# EAGLE design blous-afich (EAGLE 8.3.2)
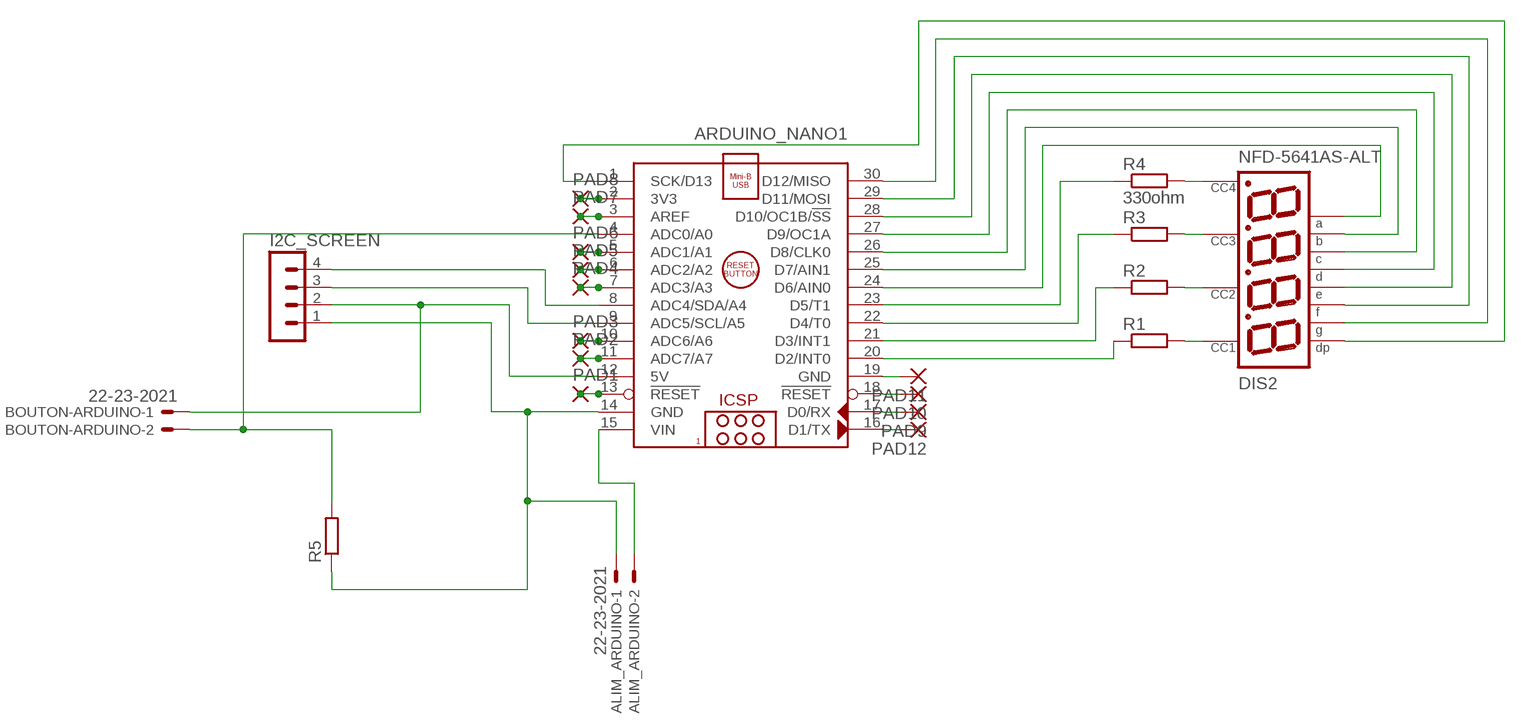
[diagram p0: schematic, sheet 1]

## Parts
ALIM_ARDUINO  22-23-2021  [22-23-2021]
ARDUINO_NANO1  ARDUINO_NANO  [ARDUINO_NANO]
BOUTON-ARDUINO  22-23-2021  [22-23-2021]
DIS2  NFD-5641AS-ALT  [NFD-5641]
I2C_SCREEN  MA04-1  [MA04-1]
PAD1  1,6/0,8  [1,6/0,8]
PAD2  1,6/0,8  [1,6/0,8]
PAD3  1,6/0,8  [1,6/0,8]
PAD4  1,6/0,8  [1,6/0,8]
PAD5  1,6/0,8  [1,6/0,8]
PAD6  1,6/0,8  [1,6/0,8]
PAD7  1,6/0,8  [1,6/0,8]
PAD8  1,6/0,8  [1,6/0,8]
PAD9  1,6/0,8  [1,6/0,8]
PAD10  1,6/0,8  [1,6/0,8]
PAD11  1,6/0,8  [1,6/0,8]
PAD12  1,6/0,8  [1,6/0,8]
R1  R-EU_0207/7  [0207/7]
R2  R-EU_0207/7  [0207/7]
R3  R-EU_0207/7  [0207/7]
R4  330ohm  R-EU_0207/7  [0207/7]
R5  R-EU_0207/7  [0207/7]

## Nets
N$1: ARDUINO_NANO1.20(D2/INT0) R1.1
N$2: ARDUINO_NANO1.21(D3/INT1) R2.1
N$3: ARDUINO_NANO1.22(D4/T0) R3.1
N$4: ARDUINO_NANO1.23(D5/T1) R4.1
N$5: DIS2.P$6 R4.2
N$6: DIS2.P$8 R3.2
N$7: DIS2.P$9 R2.2
N$8: DIS2.P$12 R1.2
N$9: ARDUINO_NANO1.24(D6/AIN0) DIS2.P$11
N$10: ARDUINO_NANO1.25(D7/AIN1) DIS2.P$7
N$11: ARDUINO_NANO1.26(D8/CLK0) DIS2.P$4
N$12: ARDUINO_NANO1.27(D9/OC1A) DIS2.P$2
N$13: ARDUINO_NANO1.28(D10/OC1B/!SS) DIS2.P$1
N$14: ARDUINO_NANO1.29(D11/MOSI) DIS2.P$10
N$15: ARDUINO_NANO1.30(D12/MISO) DIS2.P$5
N$16: ARDUINO_NANO1.1(SCK/D13) DIS2.P$3
N$17: ARDUINO_NANO1.8(ADC4/SDA/A4) I2C_SCREEN.4
N$18: ARDUINO_NANO1.9(ADC5/SCL/A5) I2C_SCREEN.3
N$19: ARDUINO_NANO1.12(5V) BOUTON-ARDUINO.1 I2C_SCREEN.2
N$20: ALIM_ARDUINO.1 ARDUINO_NANO1.14(GND) I2C_SCREEN.1 R5.1
N$21: ARDUINO_NANO1.4(ADC0/A0) BOUTON-ARDUINO.2 R5.2
N$22: ALIM_ARDUINO.2 ARDUINO_NANO1.15(VIN)
N$23: ARDUINO_NANO1.2(3V3) PAD8.1(P)
N$24: ARDUINO_NANO1.3(AREF) PAD7.1(P)
N$25: ARDUINO_NANO1.5(ADC1/A1) PAD6.1(P)
N$26: ARDUINO_NANO1.6(ADC2/A2) PAD5.1(P)
N$27: ARDUINO_NANO1.7(ADC3/A3) PAD4.1(P)
N$28: ARDUINO_NANO1.10(ADC6/A6) PAD3.1(P)
N$29: ARDUINO_NANO1.11(ADC7/A7) PAD2.1(P)
N$30: ARDUINO_NANO1.19(GND) PAD11.1(P)
N$31: ARDUINO_NANO1.18(!RESET) PAD10.1(P)
N$32: ARDUINO_NANO1.17(D0/RX) PAD9.1(P)
N$33: ARDUINO_NANO1.16(D1/TX) PAD12.1(P)
N$34: ARDUINO_NANO1.13(!RESET) PAD1.1(P)

## Library data of the parts
ALIM_ARDUINO BOUTON-ARDUINO = con-molex:22-23-2021: .100" (2.54mm) Center Header - 2 Pin; MF: MOLEX; MPN: 22-23-2021; OC_FARNELL: 1462926; OC_NEWARK: 25C3832
ARDUINO_NANO1 = ArduinoNanoV30:ARDUINO_NANO: Arduino Nano V3.0 Module Overview: The Arduino Nano is a small, complete, and breadboard-friendly board based on the ATmega328 (Arduino Nano 3.x) or ATmega168 (Arduino Nano 2.x). It has more or less the same functionality of the Arduino Duemilanove, but in a different package. It lacks only a DC power jack, and works with a Mini-B USB cable instead of a standard one. The Nano was designed and is being produced by Gravitech <http://www.gravitech.us/arna30wiatp.html>. General specifications: Item Value Microcontroller Atmel ATmega168 or ATmega328 Operating Voltage (logic level) 5 V Input Voltage (recommended) 7-12 V Input Voltage (limits) 6-20 V Digital I/O Pins 14 (of which 6 provide PWM output) Analog Input Pins 8 DC Current per I/O Pin 40 mA Flash Memory 16 KB (ATmega168) or 32 KB (ATmega328) of which 2 KB used by bootloader SRAM 1 KB (ATmega168) or 2 KB (ATmega328) EEPROM 512 bytes (ATmega168) or 1 KB (ATmega328) Clock Speed 16 MHz Dimensions (Inches) 0.73" x 1.70" Dimensions (mm) 18mm x 45mm Overall height About 9 mm (not including pins) Weigth 5 g Power: The Arduino Nano can be powered via the Mini-B USB connection, 6-20V unregulated external power supply (pin 30), or 5V regulated external power supply (pin 27). The power source is automatically selected to the highest voltage source. Memory: The ATmega168 has 16 KB of flash memory for storing code (of which 2 KB is used for the bootloader); the ATmega328 has 32 KB, (also with 2 KB used for the bootloader). The ATmega168 has 1 KB of SRAM and 512 bytes of EEPROM (which can be read and written with the EEPROM library); the ATmega328 has 2 KB of SRAM and 1 KB of EEPROM. Input and Output: Each of the 14 digital pins on the Nano can be used as an input or output, using pinMode(), digitalWrite(), and digitalRead() functions. They operate at 5 volts. Each pin can provide or receive a maximum of 40 mA and has an internal pull-up resistor (disconnected by default) of 20-50 kOhms. In addition, some pins have specialized functions. Visit Arduino - ArduinoBoardNano <https://www.arduino.cc/en/Main/ArduinoBoardNano>
DIS2 = display-nfd:NFD-5641AS-ALT: Four Digit 0.56" CC Seven-Segment LED Display Futurlec part number: 7FR5641AS Created by RobG
I2C_SCREEN = con-lstb:MA04-1: PIN HEADER; OC_FARNELL: unknown; OC_NEWARK: unknown
PAD1-PAD12 = wirepad:1,6/0,8: THROUGH-HOLE PAD
R1-R5 = rcl:R-EU_: RESISTOR, European symbol

## Board
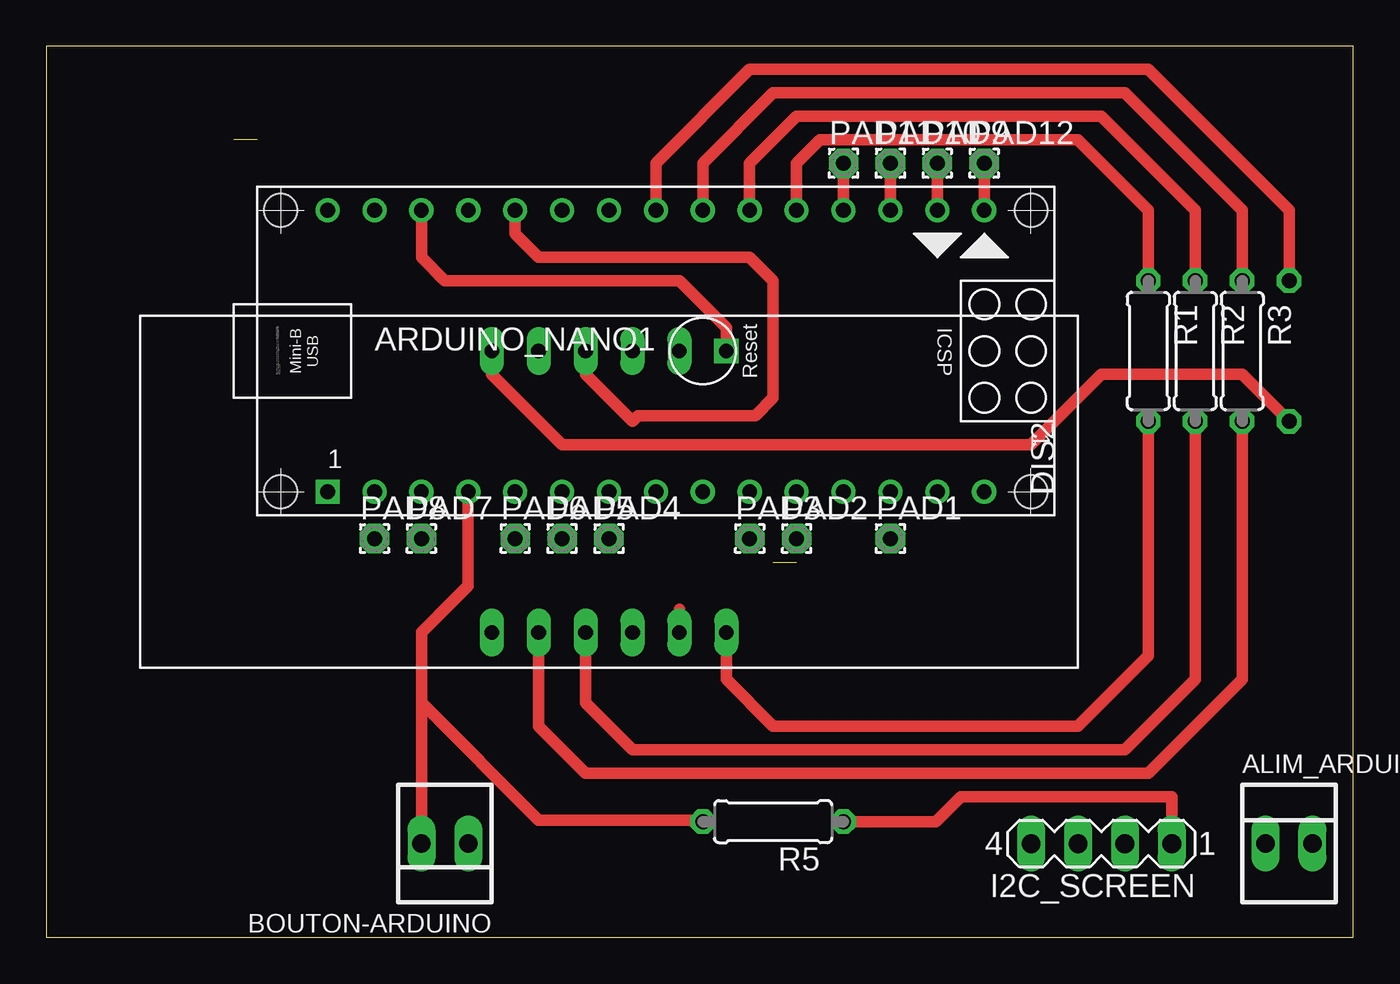
[diagram p1: board, top side]
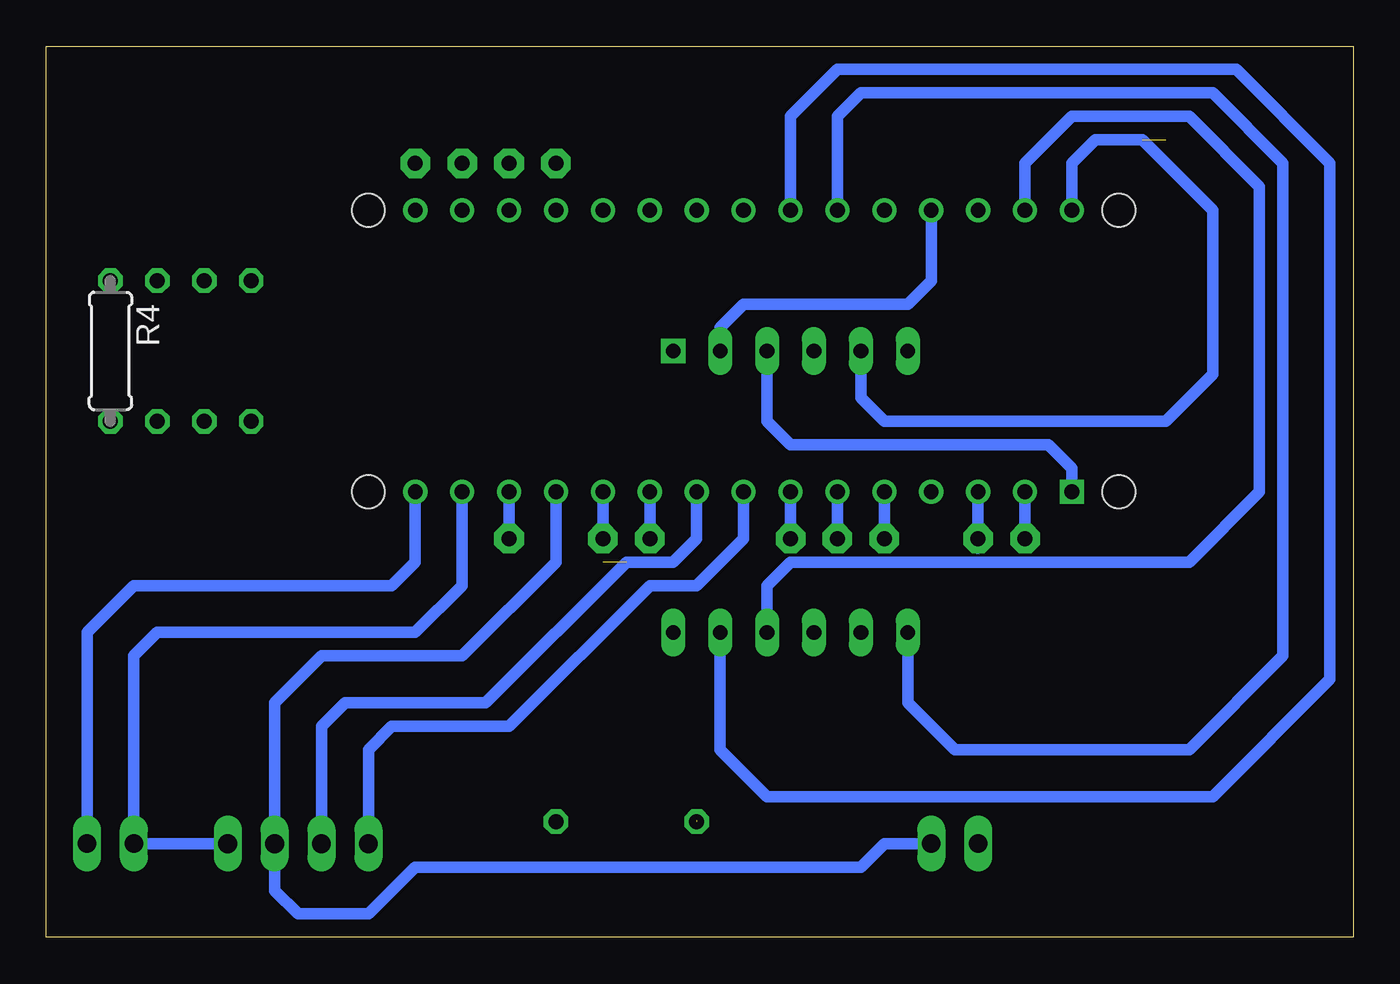
[diagram p2: board, bottom side, seen from below]

Size 70.79 x 48.25 mm. Coordinates in mm from the lower left corner, seen from the top.
Outline: 0,0 70.79,0 70.79,48.25 0,48.25 0,0
Copper layers (1*16): Top 0.035mm / dielectric 1.5mm / Bottom 0.035mm
Design rules "default": minimum track width 6mil, minimum drill 0.35mm, track to track 6mil, track to pad 6mil, pad to pad 6mil, via to via 6mil, smd to smd 6mil, copper to edge 40mil, drill to drill 6mil, minimum pad ring 10mil, minimum via ring 8mil, stop-mask expansion 4mil, vias tented up to drill 0mil, thermal gap 10mil

### Footprints (pad centres in the part's own frame; a part is rotated, then mirrored left to right if it is on the bottom)
22-23-2021 = drill 1 long: 1 -1.27,0; 2 1.27,0
ARDUINO_NANO = drill 0.8 square: 1 -20.32,-7.62 | drill 0.8: 2 -17.78,-7.62; 3 -15.24,-7.62; 4 -12.7,-7.62; 5 -10.16,-7.62; 6 -7.62,-7.62; 7 -5.08,-7.62; 8 -2.54,-7.62; 9 0,-7.62; 10 2.54,-7.62; 11 5.08,-7.62; 12 7.62,-7.62; 13 10.16,-7.62; 14 12.7,-7.62; 15 15.24,-7.62; 16 15.24,7.62; 17 12.7,7.62; 18 10.16,7.62; 19 7.62,7.62; 20 5.08,7.62; 21 2.54,7.62; 22 0,7.62; 23 -2.54,7.62; 24 -5.08,7.62; 25 -7.62,7.62; 26 -10.16,7.62; 27 -12.7,7.62; 28 -15.24,7.62; 29 -17.78,7.62; 30 -20.32,7.62 | hole 1.778: -22.86,-7.62; -22.86,7.62; 17.78,7.62; 17.78,-7.62
NFD-5641 = drill 0.8 square: P$1 -6.35,-7.62 | drill 0.8 long: P$2 -3.81,-7.62; P$3 -1.27,-7.62; P$4 1.27,-7.62; P$5 3.81,-7.62; P$6 6.35,-7.62; P$7 6.35,7.62; P$8 3.81,7.62; P$9 1.27,7.62; P$10 -1.27,7.62; P$11 -3.81,7.62; P$12 -6.35,7.62
MA04-1 = drill 1.016 long: 1 -3.81,0; 2 -1.27,0; 3 1.27,0; 4 3.81,0
1,6/0,8 = drill 0.813 pad 1.6 octagon: 1 0,0
0207/7 = drill 0.813 octagon: 1 -3.81,0; 2 3.81,0

### Placement (x,y rotation side)
ALIM_ARDUINO  67.31,5.08 0 top
ARDUINO_NANO1  35.56,31.75 0 top
BOUTON-ARDUINO  21.59,5.08 180 top
DIS2  30.48,24.13 180 top
I2C_SCREEN  57.15,5.08 180 top
PAD1  45.72,21.59 0 top
PAD2  40.64,21.59 0 top
PAD3  38.1,21.59 0 top
PAD4  30.48,21.59 0 top
PAD5  27.94,21.59 0 top
PAD6  25.4,21.59 0 top
PAD7  20.32,21.59 0 top
PAD8  17.78,21.59 0 top
PAD9  48.26,41.91 0 top
PAD10  45.72,41.91 0 top
PAD11  43.18,41.91 0 top
PAD12  50.8,41.91 0 top
R1  59.69,31.75 270 top
R2  62.23,31.75 270 top
R3  64.77,31.75 270 top
R4  67.31,31.75 270 bottom
R5  39.37,6.27 180 top

### Tracks (layer width: path | path; a pad name or v marks a point on that pad's centre or on a via)
N$1
  Top 0.61: ARDUINO_NANO1.20 40.64,41.91 41.91,43.18 55.88,43.18 59.69,39.37 R1.1
N$2
  Top 0.61: R2.1 62.23,39.37 57.15,44.45 40.64,44.45 38.1,41.91 ARDUINO_NANO1.21
N$3
  Top 0.61: R3.1 64.77,39.37 58.42,45.72 39.37,45.72 35.56,41.91 ARDUINO_NANO1.22
N$4
  Top 0.61: R4.1 67.31,39.37 59.69,46.99 38.1,46.99 33.02,41.91 ARDUINO_NANO1.23
N$5
  Top 0.61: R4.2 64.77,30.48 57.15,30.48 55.88,29.21 | DIS2.P$6 24.13,30.48 27.94,26.67 53.34,26.67 55.88,29.21 | 55.88,29.21 54.61,27.94
N$6
  Top 0.61: R3.2 64.77,13.97 59.69,8.89 29.21,8.89 26.67,11.43 DIS2.P$8
N$7
  Top 0.61: R2.2 62.23,13.97 58.42,10.16 31.75,10.16 29.21,12.7 DIS2.P$9
N$8
  Top 0.61: DIS2.P$12 36.83,13.97 39.37,11.43 55.88,11.43 59.69,15.24 R1.2
N$9
  Top 0.61: 34.29,17.78 DIS2.P$11
  Bottom 0.61: ARDUINO_NANO1.24 30.48,44.45 27.94,46.99 6.35,46.99 1.27,41.91 1.27,13.97 7.62,7.62 31.75,7.62 34.29,10.16 DIS2.P$11
N$10
  Bottom 0.61: ARDUINO_NANO1.25 27.94,44.45 26.67,45.72 7.62,45.72 3.81,41.91 3.81,15.24 8.89,10.16 21.59,10.16 24.13,12.7 DIS2.P$7
N$11
  Top 0.61: ARDUINO_NANO1.26 25.4,38.1 26.67,36.83 38.1,36.83 39.37,35.56 39.37,29.21 38.41,28.24 32.06,28.24 31.75,27.94 29.21,30.48 DIS2.P$4
N$12
  Bottom 0.61: DIS2.P$2 34.29,33.02 33.02,34.29 24.13,34.29 22.86,35.56 ARDUINO_NANO1.27
N$13
  Top 0.61: DIS2.P$1 36.83,33.02 34.29,35.56 21.59,35.56 20.32,36.83 ARDUINO_NANO1.28
N$14
  Bottom 0.61: DIS2.P$10 31.75,19.05 30.48,20.32 8.89,20.32 5.08,24.13 5.08,40.64 8.89,44.45 15.24,44.45 17.78,41.91 ARDUINO_NANO1.29
N$15  (1 unrouted)
  Bottom 0.61: DIS2.P$5 26.67,29.21 25.4,27.94 10.16,27.94 7.62,30.48 7.62,39.37 11.43,43.18 13.97,43.18 15.24,41.91 ARDUINO_NANO1.30
N$16
  Bottom 0.61: ARDUINO_NANO1.1 15.24,25.4 16.51,26.67 30.48,26.67 31.75,27.94 DIS2.P$3
N$17
  Bottom 0.61: ARDUINO_NANO1.8 33.02,21.59 35.56,19.05 38.1,19.05 45.72,11.43 52.07,11.43 53.34,10.16 I2C_SCREEN.4
N$18  (1 unrouted)
  Bottom 0.61: ARDUINO_NANO1.9 35.56,21.59 36.83,20.32 39.37,20.32 46.99,12.7 54.61,12.7 55.88,11.43 I2C_SCREEN.3
N$19
  Bottom 0.61: ARDUINO_NANO1.12 43.18,20.32 48.26,15.24 55.88,15.24 58.42,12.7 I2C_SCREEN.2 58.42,2.54 57.15,1.27 53.34,1.27 50.8,3.81 26.67,3.81 25.4,5.08 BOUTON-ARDUINO.1
N$20
  Top 0.61: I2C_SCREEN.1 60.96,7.62 49.53,7.62 48.18,6.27 R5.1
  Bottom 0.61: I2C_SCREEN.1 ALIM_ARDUINO.1 66.04,15.24 64.77,16.51 50.8,16.51 48.26,19.05 ARDUINO_NANO1.14
N$21  (1 unrouted)
  Top 0.61: 20.32,12.7 20.32,6.35 | 20.32,6.35 BOUTON-ARDUINO.2 | 20.4,6.27 20.32,6.35 | 20.32,12.7 26.67,6.35 35.56,6.35 | ARDUINO_NANO1.4 22.86,19.05 20.32,16.51 20.32,12.7
N$22
  Bottom 0.61: ARDUINO_NANO1.15 50.8,20.32 52.07,19.05 66.04,19.05 68.58,16.51 ALIM_ARDUINO.2
N$23
  Bottom 0.61: ARDUINO_NANO1.2 PAD8.1
N$24
  Bottom 0.61: ARDUINO_NANO1.3 PAD7.1 | PAD7.1 20.32,21.08 PAD7.1
N$25
  Bottom 0.61: ARDUINO_NANO1.5 PAD6.1
N$26
  Bottom 0.61: ARDUINO_NANO1.6 PAD5.1
N$27
  Bottom 0.61: ARDUINO_NANO1.7 PAD4.1
N$28
  Bottom 0.61: ARDUINO_NANO1.10 PAD3.1
N$29
  Bottom 0.61: ARDUINO_NANO1.11 PAD2.1
N$30
  Top 0.61: PAD11.1 ARDUINO_NANO1.19
N$31
  Top 0.61: PAD10.1 ARDUINO_NANO1.18
N$32
  Top 0.61: PAD9.1 ARDUINO_NANO1.17
N$33
  Top 0.61: PAD12.1 ARDUINO_NANO1.16
N$34
  Bottom 0.61: ARDUINO_NANO1.13 PAD1.1